# Altium schematic sheet headers.SchDoc
size A4
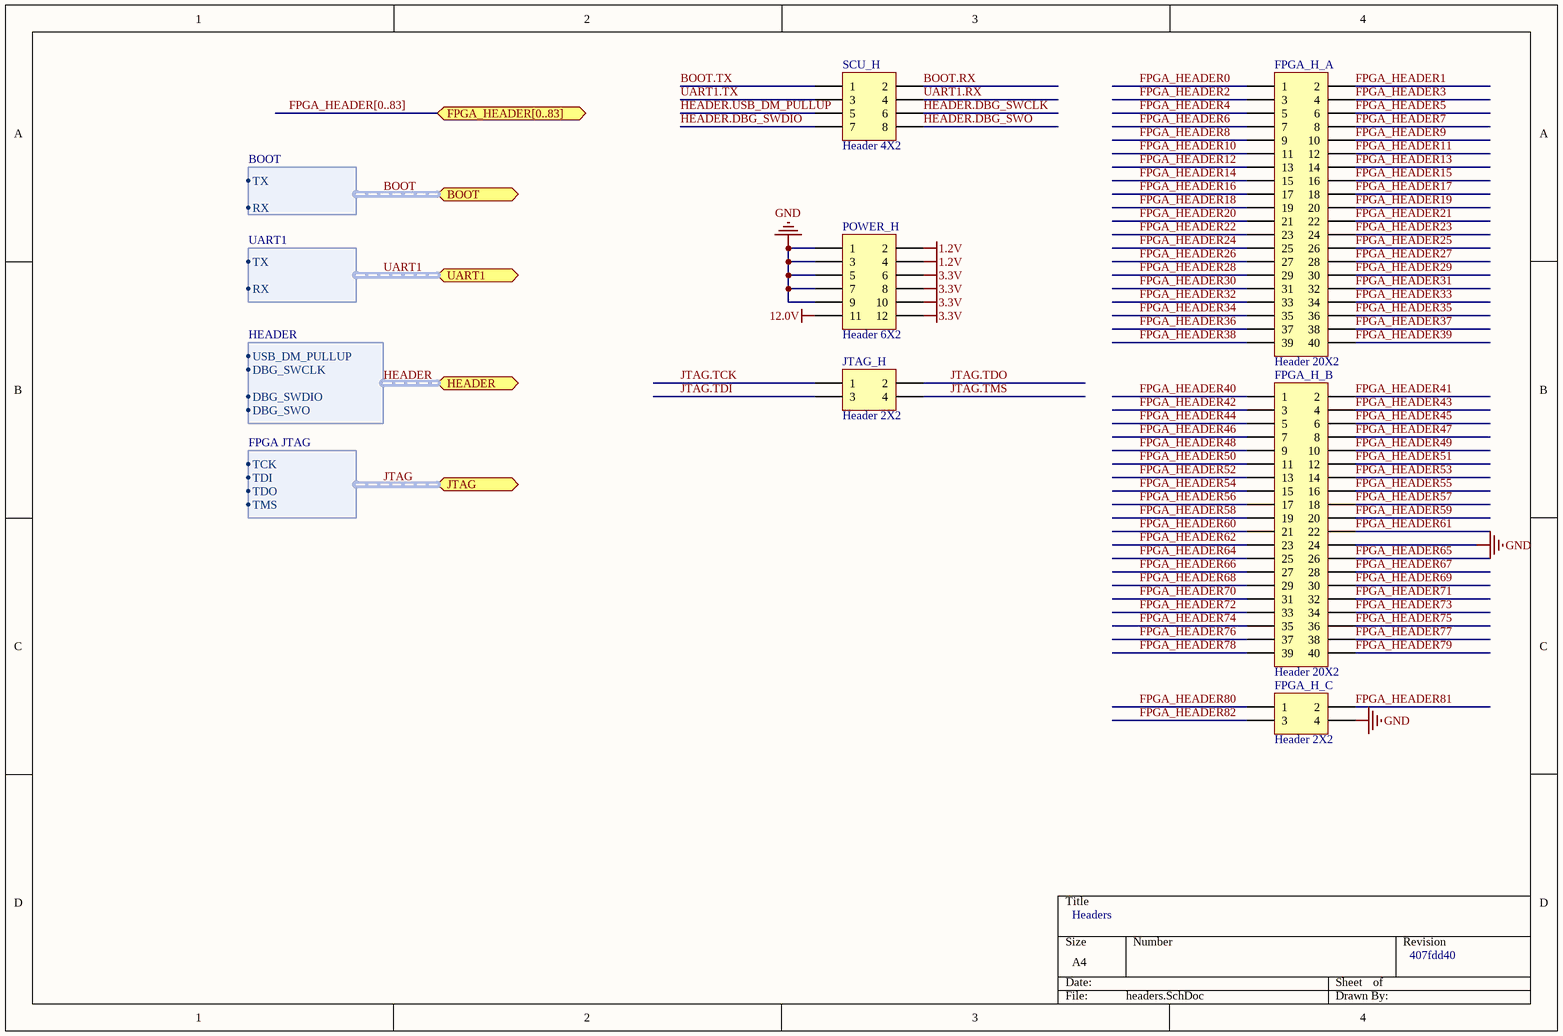
[diagram p0: headers.SchDoc]

## Parts
FPGA_H_A  Header 20X2  [HDR2X20]
FPGA_H_B  Header 20X2  [HDR2X20]
FPGA_H_C  Header 2X2  [HDR2X2]
JTAG_H  Header 2X2  [HDR2X2]
POWER_H  Header 6X2  [HDR2X6]
SCU_H  Header 4X2  [HDR2X4]

## Ports
BOOT (harness BOOT), FPGA_HEADER[0..83] (bidir), HEADER (harness HEADER), JTAG (harness FPGA JTAG), UART1 (harness UART1)

## Harnesses
UART1: TX, RX
BOOT: TX, RX
HEADER: USB_DM_PULLUP, DBG_SWCLK, DBG_SWDIO, DBG_SWO
FPGA JTAG: TCK, TDI, TMS, TDO

## Nets
1.2V: POWER_H.2 POWER_H.4
3.3V: POWER_H.6 POWER_H.8 POWER_H.10 POWER_H.12
12.0V: POWER_H.11
GND: FPGA_H_B.24 FPGA_H_C.4 POWER_H.1 POWER_H.3 POWER_H.5 POWER_H.7 POWER_H.9
BOOT.RX: SCU_H.2
BOOT.TX: SCU_H.1
FPGA_HEADER0: FPGA_H_A.1
FPGA_HEADER1: FPGA_H_A.2
FPGA_HEADER2: FPGA_H_A.3
FPGA_HEADER3: FPGA_H_A.4
FPGA_HEADER4: FPGA_H_A.5
FPGA_HEADER5: FPGA_H_A.6
FPGA_HEADER6: FPGA_H_A.7
FPGA_HEADER7: FPGA_H_A.8
FPGA_HEADER8: FPGA_H_A.9
FPGA_HEADER9: FPGA_H_A.10
FPGA_HEADER10: FPGA_H_A.11
FPGA_HEADER11: FPGA_H_A.12
FPGA_HEADER12: FPGA_H_A.13
FPGA_HEADER13: FPGA_H_A.14
FPGA_HEADER14: FPGA_H_A.15
FPGA_HEADER15: FPGA_H_A.16
FPGA_HEADER16: FPGA_H_A.17
FPGA_HEADER17: FPGA_H_A.18
FPGA_HEADER18: FPGA_H_A.19
FPGA_HEADER19: FPGA_H_A.20
FPGA_HEADER20: FPGA_H_A.21
FPGA_HEADER21: FPGA_H_A.22
FPGA_HEADER22: FPGA_H_A.23
FPGA_HEADER23: FPGA_H_A.24
FPGA_HEADER24: FPGA_H_A.25
FPGA_HEADER25: FPGA_H_A.26
FPGA_HEADER26: FPGA_H_A.27
FPGA_HEADER27: FPGA_H_A.28
FPGA_HEADER28: FPGA_H_A.29
FPGA_HEADER29: FPGA_H_A.30
FPGA_HEADER30: FPGA_H_A.31
FPGA_HEADER31: FPGA_H_A.32
FPGA_HEADER32: FPGA_H_A.33
FPGA_HEADER33: FPGA_H_A.34
FPGA_HEADER34: FPGA_H_A.35
FPGA_HEADER35: FPGA_H_A.36
FPGA_HEADER36: FPGA_H_A.37
FPGA_HEADER37: FPGA_H_A.38
FPGA_HEADER38: FPGA_H_A.39
FPGA_HEADER39: FPGA_H_A.40
FPGA_HEADER40: FPGA_H_B.1
FPGA_HEADER41: FPGA_H_B.2
FPGA_HEADER42: FPGA_H_B.3
FPGA_HEADER43: FPGA_H_B.4
FPGA_HEADER44: FPGA_H_B.5
FPGA_HEADER45: FPGA_H_B.6
FPGA_HEADER46: FPGA_H_B.7
FPGA_HEADER47: FPGA_H_B.8
FPGA_HEADER48: FPGA_H_B.9
FPGA_HEADER49: FPGA_H_B.10
FPGA_HEADER50: FPGA_H_B.11
FPGA_HEADER51: FPGA_H_B.12
FPGA_HEADER52: FPGA_H_B.13
FPGA_HEADER53: FPGA_H_B.14
FPGA_HEADER54: FPGA_H_B.15
FPGA_HEADER55: FPGA_H_B.16
FPGA_HEADER56: FPGA_H_B.17
FPGA_HEADER57: FPGA_H_B.18
FPGA_HEADER58: FPGA_H_B.19
FPGA_HEADER59: FPGA_H_B.20
FPGA_HEADER60: FPGA_H_B.21
FPGA_HEADER61: FPGA_H_B.22
FPGA_HEADER62: FPGA_H_B.23
FPGA_HEADER64: FPGA_H_B.25
FPGA_HEADER65: FPGA_H_B.26
FPGA_HEADER66: FPGA_H_B.27
FPGA_HEADER67: FPGA_H_B.28
FPGA_HEADER68: FPGA_H_B.29
FPGA_HEADER69: FPGA_H_B.30
FPGA_HEADER70: FPGA_H_B.31
FPGA_HEADER71: FPGA_H_B.32
FPGA_HEADER72: FPGA_H_B.33
FPGA_HEADER73: FPGA_H_B.34
FPGA_HEADER74: FPGA_H_B.35
FPGA_HEADER75: FPGA_H_B.36
FPGA_HEADER76: FPGA_H_B.37
FPGA_HEADER77: FPGA_H_B.38
FPGA_HEADER78: FPGA_H_B.39
FPGA_HEADER79: FPGA_H_B.40
FPGA_HEADER80: FPGA_H_C.1
FPGA_HEADER81: FPGA_H_C.2
FPGA_HEADER82: FPGA_H_C.3
HEADER.DBG_SWCLK: SCU_H.6
HEADER.DBG_SWDIO: SCU_H.7
HEADER.DBG_SWO: SCU_H.8
HEADER.USB_DM_PULLUP: SCU_H.5
JTAG.TCK: JTAG_H.1
JTAG.TDI: JTAG_H.3
JTAG.TDO: JTAG_H.2
JTAG.TMS: JTAG_H.4
UART1.RX: SCU_H.4
UART1.TX: SCU_H.3

## Buses and harness runs
bus FPGA_HEADER[0..83] = port FPGA_HEADER[0..83]
harness BOOT = port BOOT
harness HEADER = port HEADER
harness JTAG = port JTAG
harness UART1 = port UART1

## Notes on the sheet
- Headers
- 407fdd40

## Library data of the parts
FPGA_H_A FPGA_H_B = Header 20X2: Header, 20-Pin, Dual row; LatestRevisionDate: 17-Jul-2002; LatestRevisionNote: Re-released for DXP Platform.; Publisher: Altium Limited
FPGA_H_C JTAG_H = Header 2X2: Header, 2-Pin, Dual row; LatestRevisionDate: 17-Jul-2002; LatestRevisionNote: Re-released for DXP Platform.; Publisher: Altium Limited
POWER_H = Header 6X2: Header, 6-Pin, Dual row; LatestRevisionDate: 17-Jul-2002; LatestRevisionNote: Re-released for DXP Platform.; Publisher: Altium Limited
SCU_H = Header 4X2: Header, 4-Pin, Dual row; LatestRevisionDate: 17-Jul-2002; LatestRevisionNote: Re-released for DXP Platform.; Publisher: Altium Limited